# EAGLE schematic nike_relay (EAGLE 6.5.0)
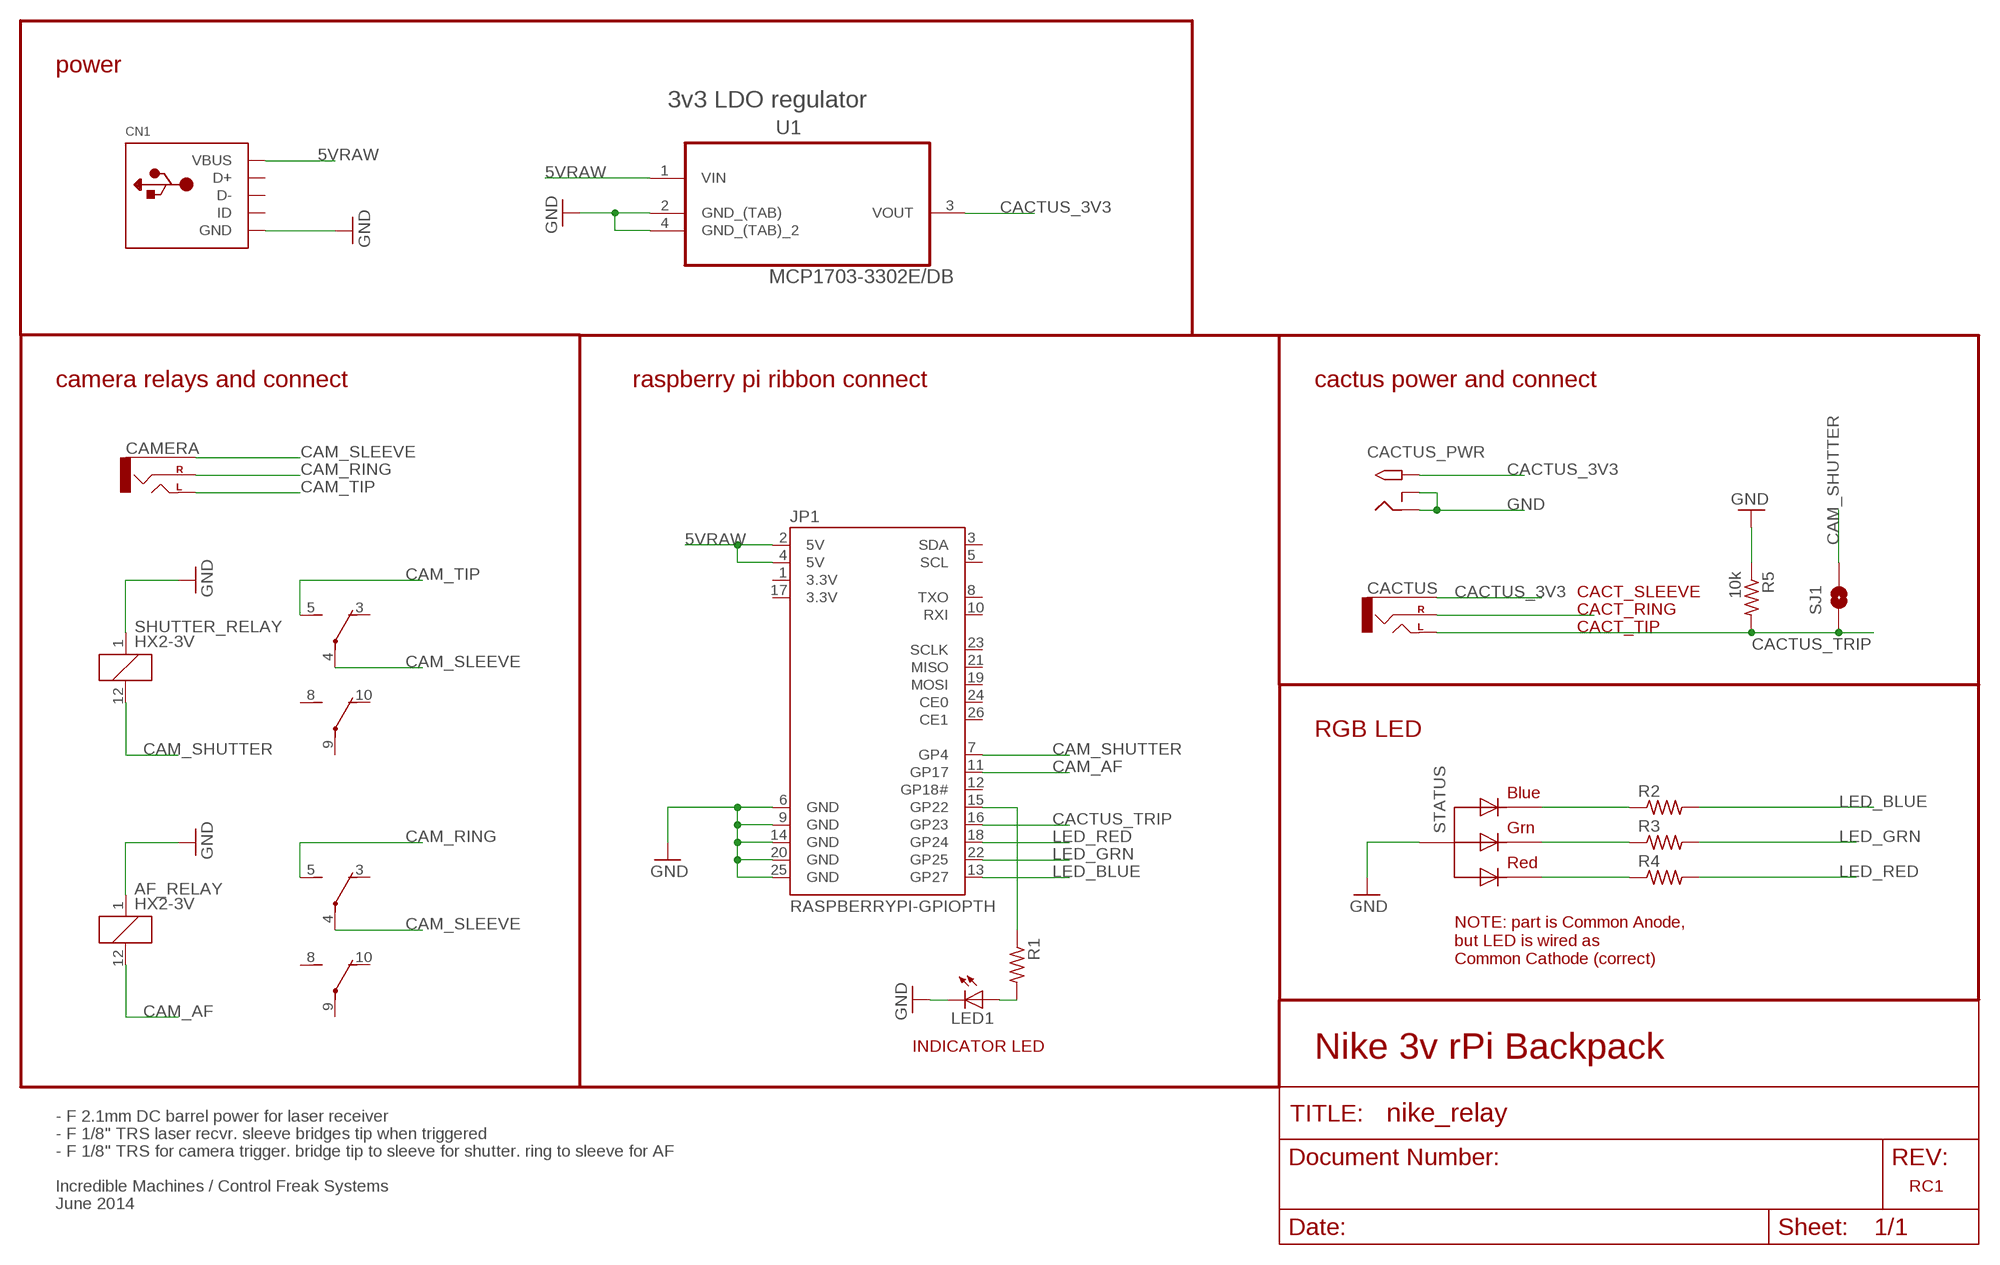
[diagram p0: schematic, sheet 1]

## Parts
AF_RELAY  HX2-3V  [HX]
CACTUS  AUDIO-JACKPTH  [AUDIO-JACK]
CACTUS_PWR  2.1MMJACKTHM  [PJ-102A]
CAMERA  AUDIO-JACKPTH  [AUDIO-JACK]
CN1  USBMOLEX  [USB-MINIB-THM-MOLEX]
JP1  RASPBERRYPI-GPIOPTH  [2X13-SHROUDED]
LED1  LED3MM  [LED3MM]
R1  R-US_0204/5  [0204/5]
R2  R-US_0204/5  [0204/5]
R3  R-US_0204/5  [0204/5]
R4  R-US_0204/5  [0204/5]
R5  10k  R-US_0204/5  [0204/5]
SHUTTER_RELAY  HX2-3V  [HX]
SJ1  SOLDERJUMPER-OLDNO  [SJ_2S-NO]
STATUS  RGBLED_CA-5MM  [LED5MMRGB]
U1  MCP1703-3302E/DB  [SOT230P700X180-4N]

## Nets
5VRAW: CN1.VBUS JP1.2(5V) JP1.4(5V) U1.1(VIN)
CACT_RING: CACTUS.RING(RIGHT)
CACTUS_3V3: CACTUS.SLEEVE CACTUS_PWR.TIP U1.3(VOUT)
CACTUS_TRIP: CACTUS.TIP(LEFT) JP1.16(GP23) R5.2 SJ1.1
CAM_AF: AF_RELAY.12 JP1.11(GP17)
CAM_RING: AF_RELAY.5(2:S) CAMERA.RING(RIGHT)
CAM_SHUTTER: JP1.7(GP4) SHUTTER_RELAY.12 SJ1.2
CAM_SLEEVE: AF_RELAY.4(2:P) CAMERA.SLEEVE SHUTTER_RELAY.4(2:P)
CAM_TIP: CAMERA.TIP(LEFT) SHUTTER_RELAY.5(2:S)
GND: AF_RELAY.1 CACTUS_PWR.RING CACTUS_PWR.RING_SW CN1.GND JP1.6(GND) JP1.9(GND) JP1.14(GND) JP1.20(GND) JP1.25(GND) LED1.K(C) R5.1 SHUTTER_RELAY.1 STATUS.2(VCC) U1.2(GND_(TAB)) U1.4(GND_(TAB)_2)
LED_BLUE: JP1.13(GP27) R2.2
LED_GRN: JP1.22(GP25) R3.2
LED_RED: JP1.18(GP24) R4.2
N$1: R2.1 STATUS.4(BLUE)
N$2: R3.1 STATUS.3(GREEN)
N$3: R4.1 STATUS.1(RED)
N$4: JP1.15(GP22) R1.1
N$5: LED1.A R1.2
Unconnected: AF_RELAY.3(2:O) AF_RELAY.8(3:S) AF_RELAY.9(3:P) AF_RELAY.10(3:O) CN1.D+ CN1.D- CN1.ID JP1.3(SDA) JP1.5(SCL) JP1.8(TXO) JP1.10(RXI) JP1.12(GP18#) JP1.19(MOSI) JP1.21(MISO) JP1.23(SCLK) JP1.24(CE0) JP1.26(CE1) SHUTTER_RELAY.3(2:O) SHUTTER_RELAY.8(3:S) SHUTTER_RELAY.9(3:P) SHUTTER_RELAY.10(3:O)

## Notes on the sheet
- power
- 3v3 LDO regulator
- camera relays and connect | raspberry pi ribbon connect | cactus power and connect
- CACT_SLEEVE
- CACT_RING
- CACT_TIP
- RGB LED
- NOTE: part is Common Anode,
  but LED is wired as 
  Common Cathode (correct)
- INDICATOR LED
- Nike 3v rPi Backpack
- - F 2.1mm DC barrel power for laser receiver
- - F 1/8" TRS laser recvr. sleeve bridges tip when triggered
- - F 1/8" TRS for camera trigger. bridge tip to sleeve for shutter. ring to sleeve for AF
- Incredible Machines / Control Freak Systems | RC1
- June 2014

## Power pins joined to a net without a drawn wire
3.3V: JP1.1(3.3V) JP1.17(3.3V)

## Library data of the parts
AF_RELAY SHUTTER_RELAY = relay:HX2-*: Compact & Slim 2 Form C Non-polarized Relay NAiS Source: http://www.mew-europe.com/.. en_ds_61011_0000.pdf; OC_FARNELL: unknown; OC_NEWARK: unknown
CACTUS CAMERA = SparkFun-Connectors:AUDIO-JACK: 3.5mm Audio Jack Simple 3.5mm common PCB mount audio jack. SKU: PRT-08032
CACTUS_PWR = adafruit:2.1MMJACK: 2.1mm x 5.5mm THM DC jack with internal switch. Digikey part #PJ-102A, 4UCON part #05537 2.1mm x 5.5mm SMT DC jack with internal switch. Digikey part #PJ-002A-SMT, 4UCON part #03267 By microbuilder.eu & adafruit.com
CN1 = adafruit:USB: USB Connectors USBMINIB - Surface Mount Female Mini-B USB Connector 4UConnector: 06564 By microbuilder.eu Thru-hole RA Female Mini-B USB Connector 4UConnector: 18732 By ladyada.net
JP1 = SparkFun-Boards:RASPBERRYPI-GPIO: RASPBERRY PI I/O HEADER As defined for the Revistion 2 Pi.; DIST: sparkfun; DIST_ID: PRT-11490
LED1 = adafruit:LED: LED OSRAM: - CHIPLED LG R971, LG N971, LY N971, LG Q971, LY Q971, LO R971, LY R971 LH N974, LH R974 LS Q976, LO Q976, LY Q976 LO Q996 - Hyper CHIPLED LW Q18S LB Q993, LB Q99A, LB R99A - SideLED LS A670, LO A670, LY A670, LG A670, LP A670 LB A673, LV A673, LT A673, LW A673 LH A674 LY A675 LS A676, LA A676, LO A676, LY A676, LW A676 LS A679, LY A679, LG A679 - Hyper Micro SIDELED® LS Y876, LA Y876, LO Y876, LY Y876 LT Y87S - SmartLED LW L88C, LW L88S LB L89C, LB L89S, LG L890 LS L89K, LO L89K, LY L89K LS L896, LA L896, LO L896, LY L896 - TOPLED LS T670, LO T670, LY T670, LG T670, LP T670 LSG T670, LSP T670, LSY T670, LOP T670, LYG T670 LG T671, LOG T671, LSG T671 LB T673, LV T673, LT T673, LW T673 LH T674 LS T676, LA T676, LO T676, LY T676, LB T676, LH T676, LSB T676, LW T676 LB T67C, LV T67C, LT T67C, LS T67K, LO T67K, LY T67K, LW E67C LS E67B, LA E67B, LO E67B, LY E67B, LB E67C, LV E67C, LT E67C LW T67C LS T679, LY T679, LG T679 LS T770, LO T770, LY T770, LG T770, LP T770 LB T773, LV T773, LT T773, LW T773 LH T774 LS E675, LA E675, LY E675, LS T675 LS T776, LA T776, LO T776, LY T776, LB T776 LHGB T686 LT T68C, LB T68C - Hyper Mini TOPLED® LB M676 - Mini TOPLED Santana® LG M470 LS M47K, LO M47K, LY M47K Source: http://www.osram.convergy.de/
R1-R5 = resistor:R-US_: RESISTOR, American symbol
SJ1 = SparkFun-Retired:SOLDERJUMPER-OLD: Solder Jumper Standard SMD solder jumper. Used to automate production. Two varients : Normally Open and Normally Closed are the same, but have different paste layers. NC will have a large amount of paste and should jumper during reflow.
STATUS = adafruit:RGBLED_CA: RGB LED, common-anode 5MM Staggered pins 5mm Piranha package http://www.ladyada.net/library/pcb/eaglelibrary.html
U1 = Microchip_By_element14_Batch_1:MCP1703-3302E/DB: IC REG LDO 3.3V 250MA; MPN: MCP1703-3302E/DB; OC_FARNELL: 1627177; OC_NEWARK: 40M0623; PACKAGE: SOT-223-3; SUPPLIER: Microchip

## Net classes
1 VCC: width 0.381 mm